# Altium project core.PrjPcb
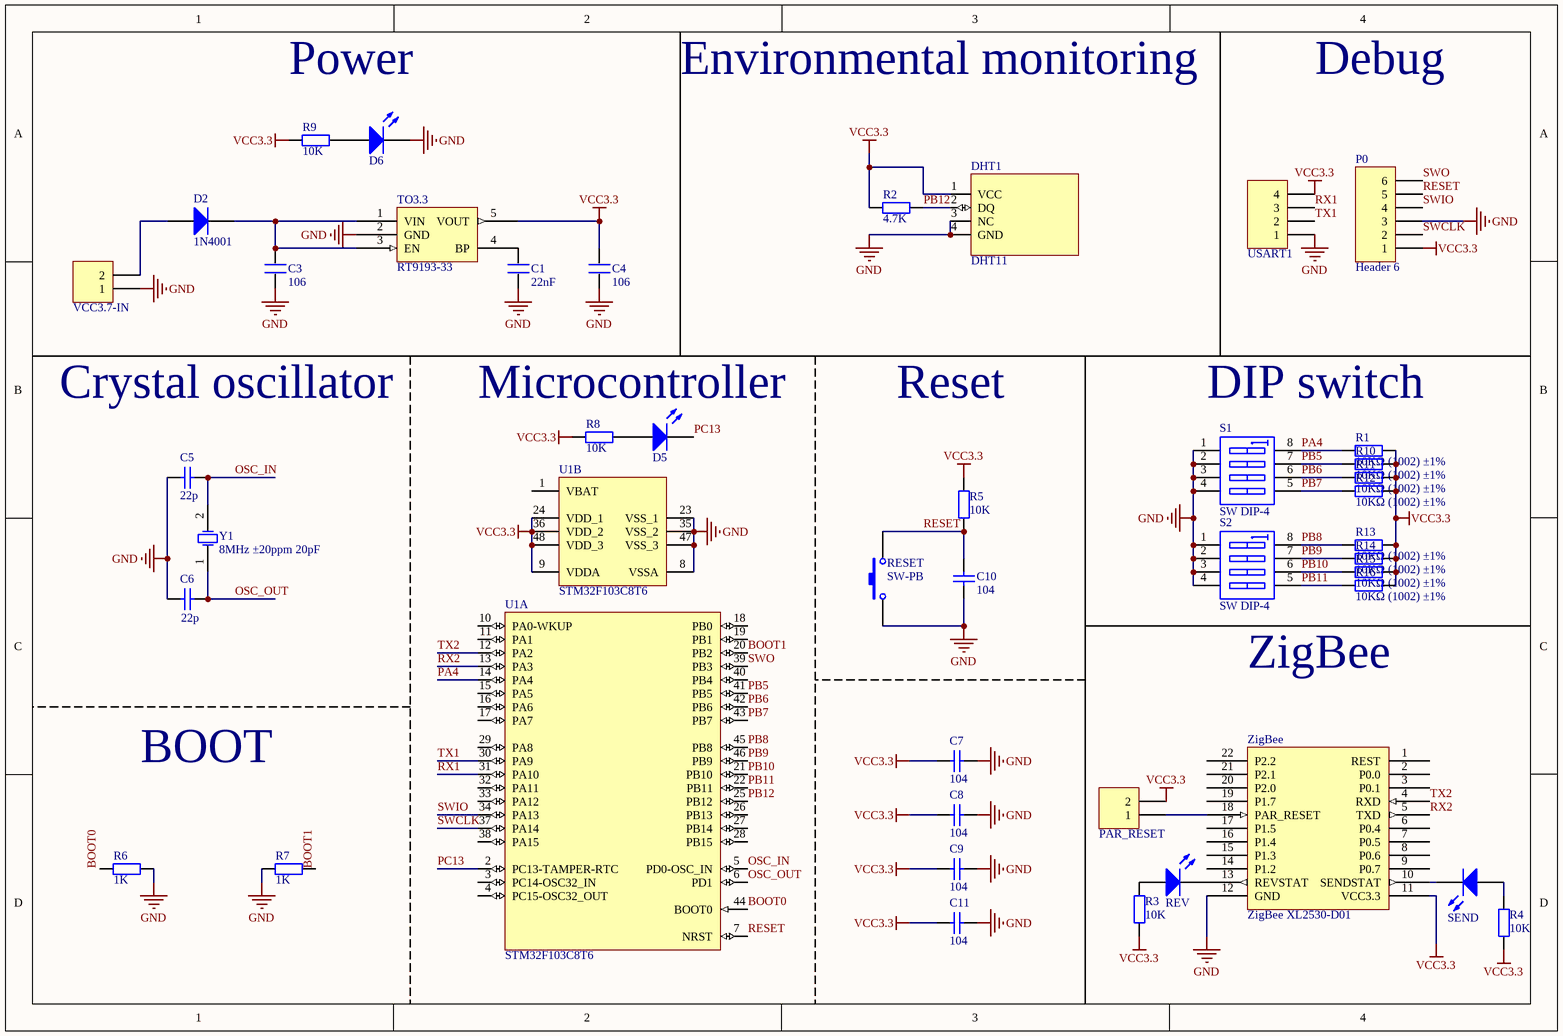
[diagram p0: Sheet2.SchDoc]
1 sheet, 43 parts. Net scope: global (net labels, ports and power ports of the same name join across sheets).
Board file: PCB1.PcbDoc

## Sheet Sheet2.SchDoc
size A4

### Parts
C1  22nF  [0805]
C3  106  [0805]
C4  106  [0805]
C5  value 22p  [C-RAD-0805]  (hidden comment: Cap)
C6  value 22p  [C-RAD-0805]  (hidden comment: Cap)
C7  value 104  [C-RAD-0805]  (hidden comment: Cap)
C8  value 104  [C-RAD-0805]  (hidden comment: Cap)
C9  value 104  [C-RAD-0805]  (hidden comment: Cap)
C10  value 104  [C-RAD-0805]  (hidden comment: Cap)
C11  value 104  [C-RAD-0805]  (hidden comment: Cap)
D2  Type: 1N4001  [DIODE-1206]  (hidden comment: Diode)
D5  LED0  [LED_0805]  (value not drawn)
D6  LED0  [LED_0805]  (value not drawn)
DHT1  DHT11  [DTH11]
P0  Header 6  [HDR1X6]
PAR_RESET  Header 2  [HDR2X1_A]  (value not drawn)
R1  10KΩ (1002) ±1%  [0805_R]
R2  value 4.7K  [0805-1]  (hidden comment: Res1)
R3  value 10K  [0805-1]  (hidden comment: Res1)
R4  value 10K  [0805-1]  (hidden comment: Res1)
R5  value 10K  [0805-1]  (hidden comment: Res1)
R6  value 1K  [0805-1]  (hidden comment: Res1)
R7  value 1K  [0805-1]  (hidden comment: Res1)
R8  value 10K  [0805-1]  (hidden comment: Res1)
R9  value 10K  [0805-1]  (hidden comment: Res1)
R10  10KΩ (1002) ±1%  [0805_R]
R11  10KΩ (1002) ±1%  [0805_R]
R12  10KΩ (1002) ±1%  [0805_R]
R13  10KΩ (1002) ±1%  [0805_R]
R14  10KΩ (1002) ±1%  [0805_R]
R15  10KΩ (1002) ±1%  [0805_R]
R16  10KΩ (1002) ±1%  [0805_R]
RESET  SW-PB  [SW_PB2_A1]
REV  LED0  [LED_0805]  (value not drawn)
S1  SW DIP-4  [SO8_xl]
S2  SW DIP-4  [SO8_xl]
SEND  LED0  [LED_0805]  (value not drawn)
TO3.3  RT9193-33  [LC-SOT-23-5]
U1  STM32F103C8T6  [LQFP-48_7x7x05P]  (parts A,B of 2)
USART1  Header 4  [HDR4X1_A]  (value not drawn)
VCC3.7-IN  Header 2  [HDR2X1_A]  (value not drawn)
Y1  8MHz ±20ppm 20pF  [SMD-5032_2P]
ZigBee  ZigBee XL2530-D01  [ZigBeeXL2530-D01]

### Nets
GND: C1.1 C3.2 C4.1 C5.1 C6.1 C7.2 C8.2 C9.2 C10.2 C11.2 D6.2(K) DHT1.3(NC) DHT1.4(GND) P0.3 R6.2 R7.1 RESET.1 S1.1(A1) S1.2(A2) S1.3(A3) S1.4(A4) S2.1(A1) S2.2(A2) S2.3(A3) S2.4(A4) TO3.3.2(GND) U1.8(VSSA) U1.23(VSS_1) U1.35(VSS_2) U1.47(VSS_3) USART1.1 VCC3.7-IN.1 ZigBee.12(GND)
VCC3.3: C4.2 C7.1 C8.1 C9.1 C11.1 DHT1.1(VCC) P0.1 PAR_RESET.2 R1.2 R2.1 R3.1 R4.1 R5.2 R8.1 R9.1 R10.2 R11.2 R12.2 R13.2 R14.2 R15.2 R16.2 TO3.3.5(VOUT) U1.9(VDDA) U1.24(VDD_1) U1.36(VDD_2) U1.48(VDD_3) USART1.4 ZigBee.11(VCC3.3)
BOOT0: R6.1 U1.44(BOOT0)
BOOT1: R7.2 U1.20(PB2)
OSC_IN: C5.2 U1.5(PD0-OSC_IN) Y1.2(OSC2)
OSC_OUT: C6.2 U1.6(PD1) Y1.1(OSC1)
PA4: R1.1 S1.8(B1) U1.14(PA4)
PB5: R10.1 S1.7(B2) U1.41(PB5)
PB6: R11.1 S1.6(B3) U1.42(PB6)
PB7: R12.1 S1.5(B4) U1.43(PB7)
PB8: R13.1 S2.8(B1) U1.45(PB8)
PB9: R14.1 S2.7(B2) U1.46(PB9)
PB10: R15.1 S2.6(B3) U1.21(PB10)
PB11: R16.1 S2.5(B4) U1.22(PB11)
PB12: DHT1.2(DQ) R2.2 U1.25(PB12)
PC13: D5.2(K) U1.2(PC13-TAMPER-RTC)
RESET: C10.1 P0.5 R5.1 RESET.2 U1.7(NRST)
RX1: U1.31(PA10) USART1.3
RX2: U1.13(PA3) ZigBee.5(TXD)
SWCLK: P0.2 U1.37(PA14)
SWIO: P0.4 U1.34(PA13)
SWO: P0.6 U1.39(PB3)
TX1: U1.30(PA9) USART1.2
TX2: U1.12(PA2) ZigBee.4(RXD)
NetC1_2: C1.2 TO3.3.4(BP)
NetC3_1: C3.1 D2.2(K) TO3.3.1(VIN) TO3.3.3(EN)
NetD2_1: D2.1(A) VCC3.7-IN.2
NetD5_1: D5.1(A) R8.2
NetD6_1: D6.1(A) R9.2
NetPAR_RESET_1: PAR_RESET.1 ZigBee.18(PAR_RESET)
NetR3_2: R3.2 REV.1(A)
NetR4_2: R4.2 SEND.1(A)
NetREV_2: REV.2(K) ZigBee.13(REVSTAT)
NetSEND_2: SEND.2(K) ZigBee.10(SENDSTAT)

Not connected (* = marked no-connect by the designer): U1 1(VBAT) 3(PC14-OSC32_IN) 4(PC15-OSC32_OUT) 10(PA0-WKUP) 11(PA1) 15(PA5) 16(PA6) 17(PA7) 18(PB0) 19(PB1) 26(PB13) 27(PB14) 28(PB15) 29(PA8) 32(PA11) 33(PA12) 38(PA15) 40(PB4); ZigBee 1(REST) 2(P0.0) 3(P0.1) 6(P0.4) 7(P0.5) 8(P0.6) 9(P0.7) 14(P1.2) 15(P1.3) 16(P1.4) 17(P1.5) 19(P1.7) 20(P2.0) 21(P2.1) 22(P2.2)

### Notes on the sheet
- Power
- Environmental monitoring
- Debug
- Crystal oscillator
- Microcontroller
- Reset
- DIP switch
- ZigBee
- BOOT
- Title
- Size:
- Date:
- A4
- Number:
- Time:
- Revision:
- Sheet
- of
- File:

### Library data of the parts
C1 C3 C4 = C
C5-C11 = Cap: 无极性电容; Published: 8-Jun-2000; LatestRevisionDate: 17-Jul-2002; LatestRevisionNote: Re-released for DXP Platform.; PackageReference: RAD-0.3; Publisher: Altium Limited
D2 = Diode: 二极管; Published: 8-Jun-2000; LatestRevisionDate: 17-Jul-2002; LatestRevisionNote: Re-released for DXP Platform.; PackageDocument: Sep-1996; PackageReference: SMC; Publisher: Altium Limited; Code_JEDEC: DO-214-AB
D5 D6 REV SEND = LED0: 发光二极管; Published: 8-Jun-2000; LatestRevisionDate: 08-Jul-2005; LatestRevisionNote: Mech Layer 1 removed.; PackageReference: LED-0; Publisher: Altium Limited
P0 = Header 6: Header, 6-Pin; LatestRevisionDate: 17-Jul-2002; LatestRevisionNote: Re-released for DXP Platform.; Publisher: Altium Limited
PAR_RESET VCC3.7-IN = Header 2: 接插件; LatestRevisionDate: 17-Jul-2002; LatestRevisionNote: Re-released for DXP Platform.; Publisher: Altium Limited
R1 R10-R16 = 0805 10KΩ (1002) 1%: 贴片电阻; ComponentLink1Description: 供应商链接; ComponentLink1URL: http://www.szlcsc.com/product/details_18102.html; Package: 0805; Supplier: LC; SuppliersPartNumber: C17414
R2-R9 = Res1: 贴片电阻; Published: 8-Jun-2000; LatestRevisionDate: 17-Jul-2002; LatestRevisionNote: Re-released for DXP Platform.; PackageReference: AXIAL-0.4; Publisher: Altium Limited
RESET = SW-PB: 微动开关; Published: 24-Mar-1999; LatestRevisionDate: 17-Jul-2002; LatestRevisionNote: Re-released for DXP Platform.; PackageReference: SPST-2; Publisher: Altium Limited
S1 S2 = SW DIP-4: DIP Switch, 4 Position, SPST; Published: 24-Mar-1999; LatestRevisionDate: 29-May-2009; LatestRevisionNote: IPC-7351 Footprint Added.; PackageVersion: Dec-2002; PackageReference: SO8; Publisher: Altium Limited; PackageDescription: 8-Pin Small Outline Integrated Circuit 1.27 mm Pitch; Code_JEDEC: MS-012-AA; Code_IPC: SOIC127P600-8
U1 = STM32F103C8T6: ARM; ComponentLink1Description: 供应商链接; ComponentLink1URL: http://www.szlcsc.com/product/details_9243.html; Package: LQFP-48_7x7x05P; Supplier: LC; SuppliersPartNumber: C8734
USART1 = Header 4: 接插件; LatestRevisionDate: 17-Jul-2002; LatestRevisionNote: Re-released for DXP Platform.; Publisher: Altium Limited
Y1 = SMD-5032_2P 8MHz 20ppm 20pF: 贴片晶振; ComponentLink1Description: 供应商链接; ComponentLink1URL: http://www.szlcsc.com/product/details_117214.html; Package: SMD-5032_2P; Supplier: LC; SuppliersPartNumber: C115962